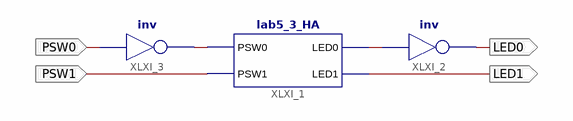
[diagram p0: schematic sheet 1]
// Xilinx ISE schematic lab5_4_HS.sch (spartan3) as structural Verilog: 3 symbols, 4 ports
module lab5_4_HS (
  input  PSW1,
  input  PSW0,
  output LED1,
  output LED0
);

  wire XLXN_1, XLXN_2;

  lab5_3_HA XLXI_1 (.LED0(XLXN_1), .LED1(LED1), .PSW0(XLXN_2), .PSW1(PSW1));
  not XLXI_2 (LED0, XLXN_1);
  not XLXI_3 (XLXN_2, PSW0);
endmodule
